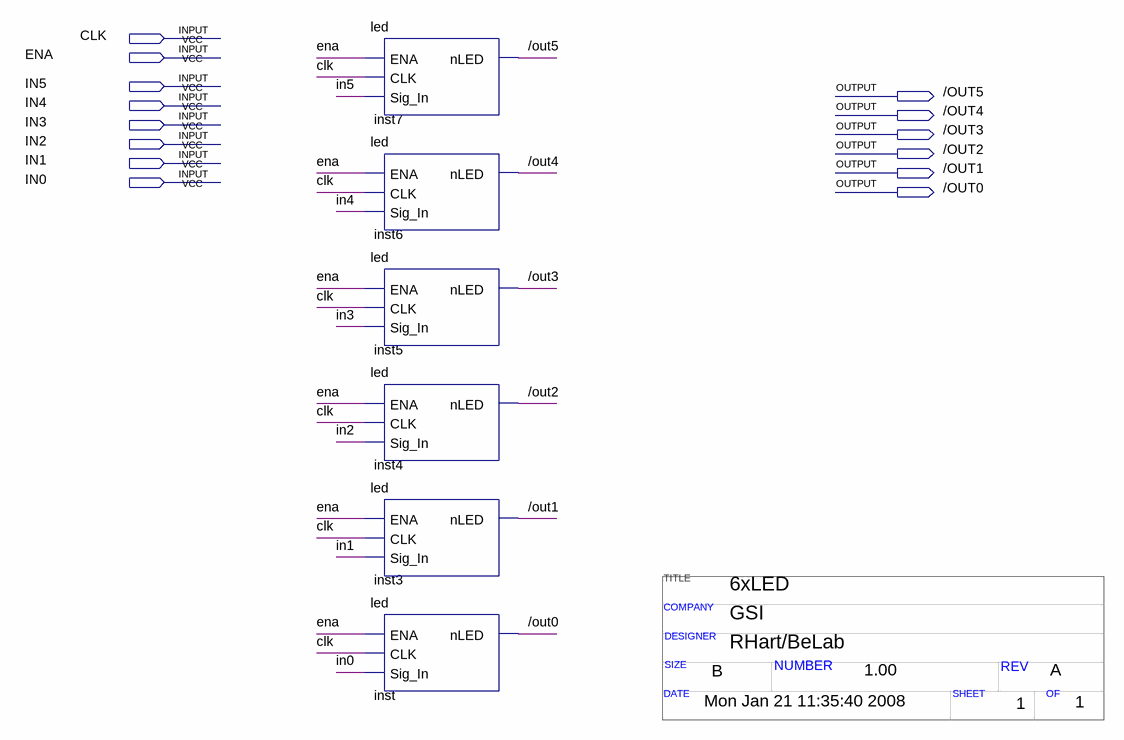
[diagram p0: schematic sheet]
// Quartus schematic 6xled.bdf as structural Verilog: 6 symbols, 14 pins
// Title block: TITLE: 6xLED; COMPANY: GSI; DESIGNER: RHart/BeLab; SIZE: B; NUMBER: 1.00; REV: A; DATE: Mon Jan 21 11:35:40 2008; SHEET: 1; OF: 1
module \6xled  (
  input  CLK,
  input  ENA,
  input  IN5,
  input  IN4,
  input  IN3,
  input  IN2,
  input  IN1,
  input  IN0,
  output \/OUT5 ,
  output \/OUT4 ,
  output \/OUT3 ,
  output \/OUT2 ,
  output \/OUT1 ,
  output \/OUT0 
);

  led inst7 (.ENA(ENA), .CLK(CLK), .Sig_In(IN5), .nLED(\/OUT5 ));
  led inst6 (.ENA(ENA), .CLK(CLK), .Sig_In(IN4), .nLED(\/OUT4 ));
  led inst5 (.ENA(ENA), .CLK(CLK), .Sig_In(IN3), .nLED(\/OUT3 ));
  led inst4 (.ENA(ENA), .CLK(CLK), .Sig_In(IN2), .nLED(\/OUT2 ));
  led inst3 (.ENA(ENA), .CLK(CLK), .Sig_In(IN1), .nLED(\/OUT1 ));
  led inst (.ENA(ENA), .CLK(CLK), .Sig_In(IN0), .nLED(\/OUT0 ));
endmodule
